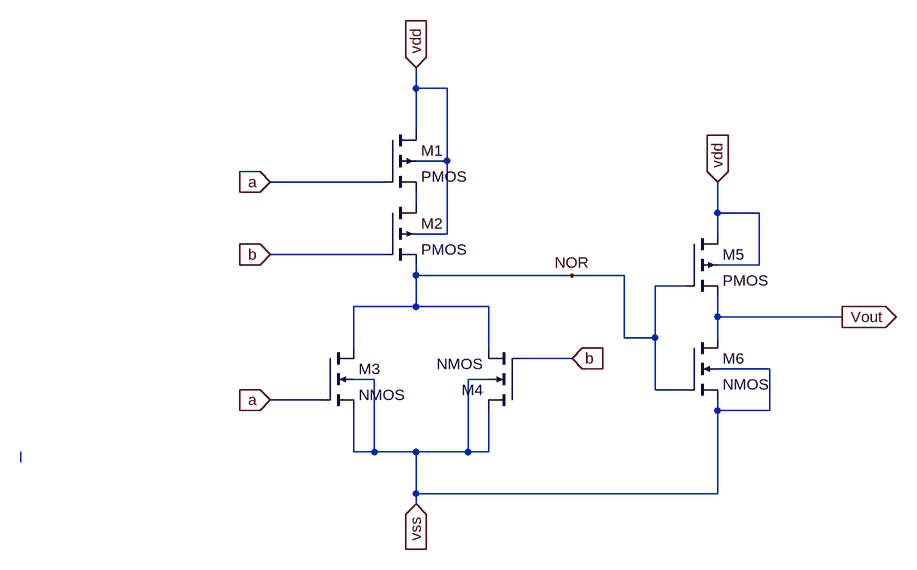
[diagram p0: schematic or.asc]
or.asc, the LTspice schematic file:
Version 4
SHEET 1 1024 680
WIRE 256 -176 256 -208
WIRE 304 -176 256 -176
WIRE 256 -112 256 -176
WIRE 304 -64 304 -176
WIRE 304 -64 256 -64
WIRE 208 -32 32 -32
WIRE 256 0 256 -16
WIRE 720 16 720 -32
WIRE 784 16 720 16
WIRE 304 48 304 -64
WIRE 304 48 256 48
WIRE 720 48 720 16
WIRE 208 80 32 80
WIRE 784 96 784 16
WIRE 784 96 720 96
WIRE 256 112 256 96
WIRE 496 112 256 112
WIRE 576 112 496 112
WIRE 672 128 624 128
WIRE 256 160 256 112
WIRE 256 160 160 160
WIRE 368 160 256 160
WIRE 720 176 720 144
WIRE 912 176 720 176
WIRE 576 208 576 112
WIRE 624 208 624 128
WIRE 624 208 576 208
WIRE 720 208 720 176
WIRE 160 224 160 160
WIRE 368 224 368 160
WIRE 496 240 416 240
WIRE 800 256 720 256
WIRE 192 272 160 272
WIRE 368 272 336 272
WIRE 624 288 624 208
WIRE 672 288 624 288
WIRE 112 304 32 304
WIRE 720 320 720 304
WIRE 800 320 800 256
WIRE 800 320 720 320
WIRE 160 384 160 320
WIRE 192 384 192 272
WIRE 192 384 160 384
WIRE 256 384 192 384
WIRE 336 384 336 272
WIRE 336 384 256 384
WIRE 368 384 368 320
WIRE 368 384 336 384
WIRE -352 400 -352 384
WIRE 256 448 256 384
WIRE 720 448 720 320
WIRE 720 448 256 448
WIRE 256 464 256 448
FLAG 496 112 NOR
FLAG 256 -208 vdd
IOPIN 256 -208 In
FLAG 32 -32 a
IOPIN 32 -32 In
FLAG 32 80 b
IOPIN 32 80 In
FLAG 32 304 a
IOPIN 32 304 In
FLAG 496 240 b
IOPIN 496 240 In
FLAG 256 464 vss
IOPIN 256 464 In
FLAG 720 -32 vdd
IOPIN 720 -32 In
FLAG 912 176 Vout
IOPIN 912 176 Out
SYMBOL pmos4 672 48 R0
SYMATTR InstName M5
SYMATTR Value2 l=1.8u w=2.18u
SYMBOL nmos4 672 208 R0
SYMATTR InstName M6
SYMATTR Value2 l=1.8u w=1u
SYMBOL pmos4 208 -112 R0
SYMATTR InstName M1
SYMATTR Value2 l=1.8u w=4.36u
SYMBOL pmos4 208 0 R0
SYMATTR InstName M2
SYMATTR Value2 l=1.8u w=4.36u
SYMBOL nmos4 112 224 R0
SYMATTR InstName M3
SYMATTR Value2 l=1.8u w=1u
SYMBOL nmos4 416 320 R180
SYMATTR InstName M4
SYMATTR Value2 l=1.8u w=1u

The netlist it stands for:
* or.asc
M5 vdd NOR Vout vdd PMOS l=1.8u w=2.18u
M6 Vout NOR vss vss NMOS l=1.8u w=1u
M1 vdd a N001 vdd PMOS l=1.8u w=4.36u
M2 N001 b NOR vdd PMOS l=1.8u w=4.36u
M3 NOR a vss vss NMOS l=1.8u w=1u
M4 vss b NOR vss NMOS l=1.8u w=1u
.model NMOS NMOS
.model PMOS PMOS
.lib standard.mos
.backanno
.end